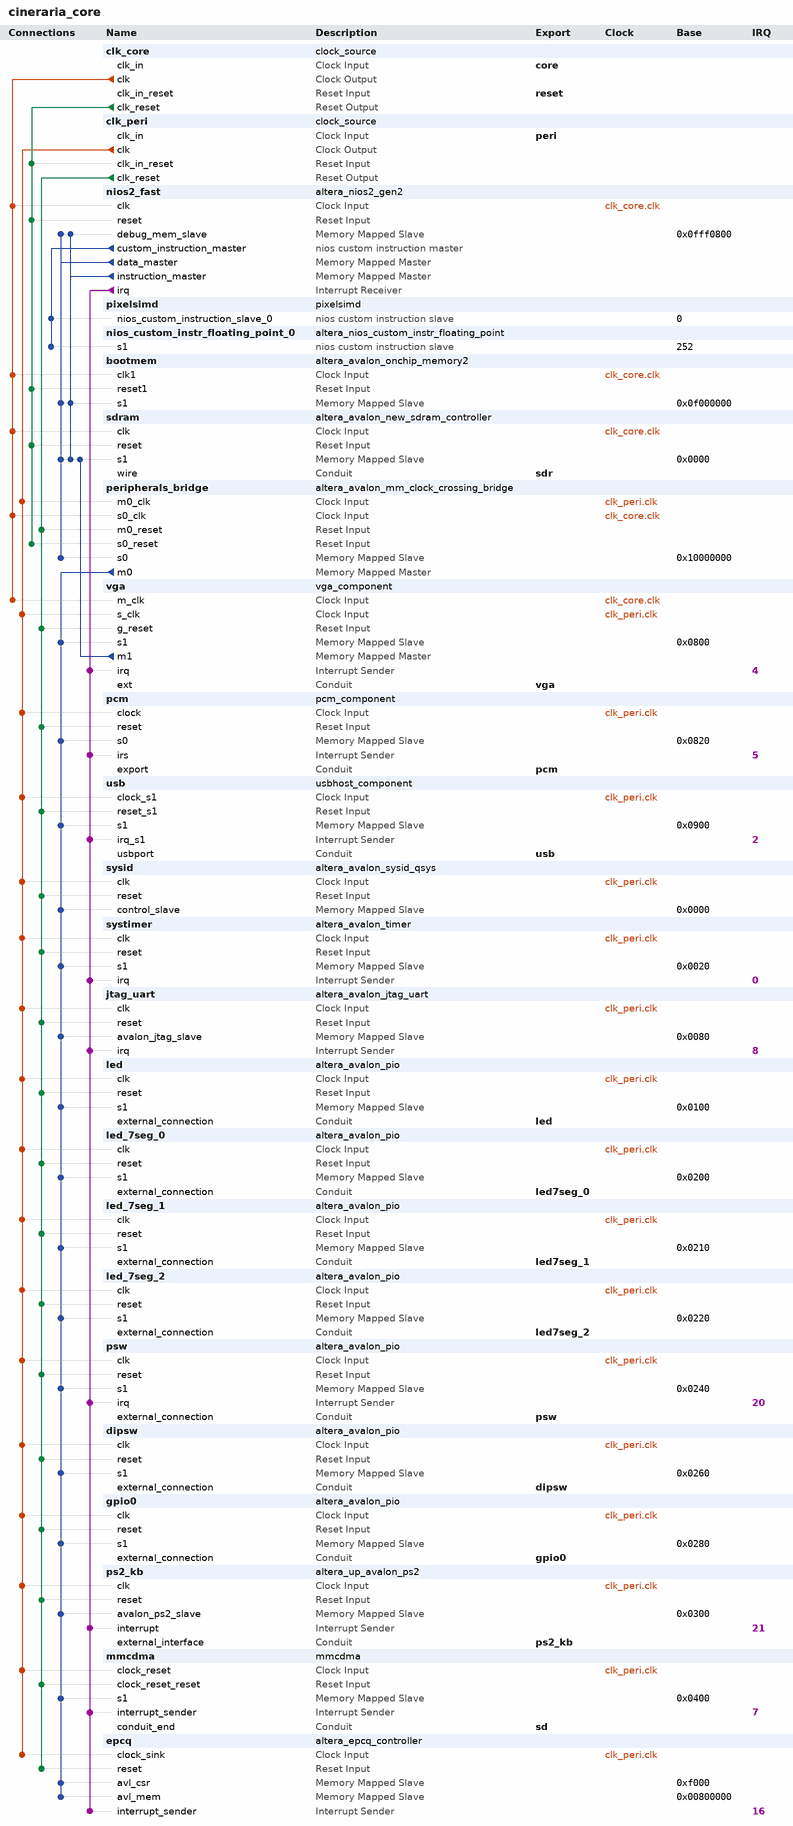
[diagram p0: system contents]
# Platform Designer (Qsys) system cineraria_core, Cyclone V 5CEBA4F23C7
# Parameters at their usual value, and those the tool derives, are not listed.
package require -exact qsys 15.0
create_system cineraria_core
set_project_property DEVICE_FAMILY {Cyclone V}
set_project_property DEVICE 5CEBA4F23C7

add_instance clk_core clock_source 15.0
set_instance_parameter_value clk_core clockFrequency 133333333

add_instance clk_peri clock_source 15.0
set_instance_parameter_value clk_peri clockFrequency 50000000

add_instance nios2_fast altera_nios2_gen2 15.0
set_instance_parameter_value nios2_fast dcache_bursts true
set_instance_parameter_value nios2_fast dcache_size 32768
set_instance_parameter_value nios2_fast dividerType srt2
set_instance_parameter_value nios2_fast exceptionSlave sdram.s1
set_instance_parameter_value nios2_fast icache_burstType Sequential
set_instance_parameter_value nios2_fast icache_size 32768
set_instance_parameter_value nios2_fast impl Fast
set_instance_parameter_value nios2_fast mul_64_impl 1
set_instance_parameter_value nios2_fast mul_shift_choice 1
set_instance_parameter_value nios2_fast resetSlave bootmem.s1

add_instance pixelsimd pixelsimd 1.0

add_instance nios_custom_instr_floating_point_0 altera_nios_custom_instr_floating_point 15.0

add_instance bootmem altera_avalon_onchip_memory2 15.0
set_instance_parameter_value bootmem dataWidth 32
set_instance_parameter_value bootmem dualPort false
set_instance_parameter_value bootmem initMemContent true
set_instance_parameter_value bootmem initializationFileName boot.hex
set_instance_parameter_value bootmem memorySize 65536
set_instance_parameter_value bootmem useNonDefaultInitFile true

add_instance sdram altera_avalon_new_sdram_controller 15.0
set_instance_parameter_value sdram TAC 5.4
set_instance_parameter_value sdram TRCD 15.0
set_instance_parameter_value sdram TRP 15.0
set_instance_parameter_value sdram casLatency 3
set_instance_parameter_value sdram columnWidth 10
set_instance_parameter_value sdram dataWidth 16
set_instance_parameter_value sdram generateSimulationModel false
set_instance_parameter_value sdram model single_Micron_MT48LC4M32B2_7_chip
set_instance_parameter_value sdram numberOfBanks 4
set_instance_parameter_value sdram numberOfChipSelects 1
set_instance_parameter_value sdram powerUpDelay 100.0
set_instance_parameter_value sdram refreshPeriod 7.8125
set_instance_parameter_value sdram rowWidth 13

add_instance peripherals_bridge altera_avalon_mm_clock_crossing_bridge 15.0
set_instance_parameter_value peripherals_bridge ADDRESS_WIDTH 10
set_instance_parameter_value peripherals_bridge COMMAND_FIFO_DEPTH 4
set_instance_parameter_value peripherals_bridge DATA_WIDTH 32
set_instance_parameter_value peripherals_bridge MASTER_SYNC_DEPTH 2
set_instance_parameter_value peripherals_bridge MAX_BURST_SIZE 1
set_instance_parameter_value peripherals_bridge RESPONSE_FIFO_DEPTH 4
set_instance_parameter_value peripherals_bridge SLAVE_SYNC_DEPTH 2
set_instance_parameter_value peripherals_bridge USE_AUTO_ADDRESS_WIDTH 1

add_instance vga vga_component 1.1
set_instance_parameter_value vga H_ACTIVE 640
set_instance_parameter_value vga H_BACKP 48
set_instance_parameter_value vga H_SYNC 96
set_instance_parameter_value vga H_TOTAL 800
set_instance_parameter_value vga LINEOFFSETBYTES 2048
set_instance_parameter_value vga V_ACTIVE 480
set_instance_parameter_value vga V_BACKP 33
set_instance_parameter_value vga V_SYNC 2
set_instance_parameter_value vga V_TOTAL 525

add_instance pcm pcm_component 1.0

add_instance usb usbhost_component 1.0
set_instance_parameter_value usb HOST_FIFO_ADDR_WIDTH 6
set_instance_parameter_value usb HOST_FIFO_DEPTH 64

add_instance sysid altera_avalon_sysid_qsys 15.0
set_instance_parameter_value sysid id 538249488

add_instance systimer altera_avalon_timer 15.0
set_instance_parameter_value systimer period 1
set_instance_parameter_value systimer periodUnits MSEC

add_instance jtag_uart altera_avalon_jtag_uart 15.0
set_instance_parameter_value jtag_uart simInteractiveOptions NO_INTERACTIVE_WINDOWS

add_instance led altera_avalon_pio 15.0
set_instance_parameter_value led direction Output
set_instance_parameter_value led width 10

add_instance led_7seg_0 altera_avalon_pio 15.0
set_instance_parameter_value led_7seg_0 direction Output
set_instance_parameter_value led_7seg_0 width 16

add_instance led_7seg_1 altera_avalon_pio 15.0
set_instance_parameter_value led_7seg_1 direction Output
set_instance_parameter_value led_7seg_1 width 16

add_instance led_7seg_2 altera_avalon_pio 15.0
set_instance_parameter_value led_7seg_2 direction Output
set_instance_parameter_value led_7seg_2 width 16

add_instance psw altera_avalon_pio 15.0
set_instance_parameter_value psw captureEdge true
set_instance_parameter_value psw direction Input
set_instance_parameter_value psw edgeType FALLING
set_instance_parameter_value psw generateIRQ true
set_instance_parameter_value psw irqType EDGE
set_instance_parameter_value psw width 4

add_instance dipsw altera_avalon_pio 15.0
set_instance_parameter_value dipsw direction Input
set_instance_parameter_value dipsw width 10

add_instance gpio0 altera_avalon_pio 15.0
set_instance_parameter_value gpio0 direction Bidir
set_instance_parameter_value gpio0 width 32

add_instance ps2_kb altera_up_avalon_ps2 15.0

add_instance mmcdma mmcdma 1.0
set_instance_parameter_value mmcdma SYSTEMCLOCKINFO 50000000

add_instance epcq altera_epcq_controller 15.0
set_instance_parameter_value epcq CHIP_SELS 1
set_instance_parameter_value epcq DDASI 0
set_instance_parameter_value epcq FLASH_TYPE EPCS64
set_instance_parameter_value epcq IO_MODE STANDARD

# connections
add_connection clk_core.clk bootmem.clk1 clock
add_connection clk_core.clk nios2_fast.clk clock
add_connection clk_core.clk peripherals_bridge.s0_clk clock
add_connection clk_core.clk sdram.clk clock
add_connection clk_core.clk vga.m_clk clock
add_connection clk_peri.clk dipsw.clk clock
add_connection clk_peri.clk epcq.clock_sink clock
add_connection clk_peri.clk gpio0.clk clock
add_connection clk_peri.clk jtag_uart.clk clock
add_connection clk_peri.clk led.clk clock
add_connection clk_peri.clk led_7seg_0.clk clock
add_connection clk_peri.clk led_7seg_1.clk clock
add_connection clk_peri.clk led_7seg_2.clk clock
add_connection clk_peri.clk mmcdma.clock_reset clock
add_connection clk_peri.clk pcm.clock clock
add_connection clk_peri.clk peripherals_bridge.m0_clk clock
add_connection clk_peri.clk ps2_kb.clk clock
add_connection clk_peri.clk psw.clk clock
add_connection clk_peri.clk sysid.clk clock
add_connection clk_peri.clk systimer.clk clock
add_connection clk_peri.clk usb.clock_s1 clock
add_connection clk_peri.clk vga.s_clk clock
add_connection clk_core.clk_reset bootmem.reset1 reset
add_connection clk_core.clk_reset clk_peri.clk_in_reset reset
add_connection clk_core.clk_reset nios2_fast.reset reset
add_connection clk_core.clk_reset peripherals_bridge.s0_reset reset
add_connection clk_core.clk_reset sdram.reset reset
add_connection clk_peri.clk_reset dipsw.reset reset
add_connection clk_peri.clk_reset epcq.reset reset
add_connection clk_peri.clk_reset gpio0.reset reset
add_connection clk_peri.clk_reset jtag_uart.reset reset
add_connection clk_peri.clk_reset led.reset reset
add_connection clk_peri.clk_reset led_7seg_0.reset reset
add_connection clk_peri.clk_reset led_7seg_1.reset reset
add_connection clk_peri.clk_reset led_7seg_2.reset reset
add_connection clk_peri.clk_reset mmcdma.clock_reset_reset reset
add_connection clk_peri.clk_reset pcm.reset reset
add_connection clk_peri.clk_reset peripherals_bridge.m0_reset reset
add_connection clk_peri.clk_reset ps2_kb.reset reset
add_connection clk_peri.clk_reset psw.reset reset
add_connection clk_peri.clk_reset sysid.reset reset
add_connection clk_peri.clk_reset systimer.reset reset
add_connection clk_peri.clk_reset usb.reset_s1 reset
add_connection clk_peri.clk_reset vga.g_reset reset
add_connection nios2_fast.data_master bootmem.s1 avalon
set_connection_parameter_value nios2_fast.data_master/bootmem.s1 baseAddress 0x0f000000
add_connection nios2_fast.data_master nios2_fast.debug_mem_slave avalon
set_connection_parameter_value nios2_fast.data_master/nios2_fast.debug_mem_slave baseAddress 0x0fff0800
add_connection nios2_fast.data_master peripherals_bridge.s0 avalon
set_connection_parameter_value nios2_fast.data_master/peripherals_bridge.s0 baseAddress 0x10000000
add_connection nios2_fast.data_master sdram.s1 avalon
set_connection_parameter_value nios2_fast.data_master/sdram.s1 baseAddress 0x0000
add_connection nios2_fast.instruction_master bootmem.s1 avalon
set_connection_parameter_value nios2_fast.instruction_master/bootmem.s1 baseAddress 0x0f000000
add_connection nios2_fast.instruction_master nios2_fast.debug_mem_slave avalon
set_connection_parameter_value nios2_fast.instruction_master/nios2_fast.debug_mem_slave baseAddress 0x0fff0800
add_connection nios2_fast.instruction_master sdram.s1 avalon
set_connection_parameter_value nios2_fast.instruction_master/sdram.s1 baseAddress 0x0000
add_connection peripherals_bridge.m0 dipsw.s1 avalon
set_connection_parameter_value peripherals_bridge.m0/dipsw.s1 baseAddress 0x0260
add_connection peripherals_bridge.m0 epcq.avl_csr avalon
set_connection_parameter_value peripherals_bridge.m0/epcq.avl_csr baseAddress 0xf000
add_connection peripherals_bridge.m0 epcq.avl_mem avalon
set_connection_parameter_value peripherals_bridge.m0/epcq.avl_mem baseAddress 0x00800000
add_connection peripherals_bridge.m0 gpio0.s1 avalon
set_connection_parameter_value peripherals_bridge.m0/gpio0.s1 baseAddress 0x0280
add_connection peripherals_bridge.m0 jtag_uart.avalon_jtag_slave avalon
set_connection_parameter_value peripherals_bridge.m0/jtag_uart.avalon_jtag_slave baseAddress 0x0080
add_connection peripherals_bridge.m0 led.s1 avalon
set_connection_parameter_value peripherals_bridge.m0/led.s1 baseAddress 0x0100
add_connection peripherals_bridge.m0 led_7seg_0.s1 avalon
set_connection_parameter_value peripherals_bridge.m0/led_7seg_0.s1 baseAddress 0x0200
add_connection peripherals_bridge.m0 led_7seg_1.s1 avalon
set_connection_parameter_value peripherals_bridge.m0/led_7seg_1.s1 baseAddress 0x0210
add_connection peripherals_bridge.m0 led_7seg_2.s1 avalon
set_connection_parameter_value peripherals_bridge.m0/led_7seg_2.s1 baseAddress 0x0220
add_connection peripherals_bridge.m0 mmcdma.s1 avalon
set_connection_parameter_value peripherals_bridge.m0/mmcdma.s1 baseAddress 0x0400
add_connection peripherals_bridge.m0 pcm.s0 avalon
set_connection_parameter_value peripherals_bridge.m0/pcm.s0 baseAddress 0x0820
add_connection peripherals_bridge.m0 ps2_kb.avalon_ps2_slave avalon
set_connection_parameter_value peripherals_bridge.m0/ps2_kb.avalon_ps2_slave baseAddress 0x0300
add_connection peripherals_bridge.m0 psw.s1 avalon
set_connection_parameter_value peripherals_bridge.m0/psw.s1 baseAddress 0x0240
add_connection peripherals_bridge.m0 sysid.control_slave avalon
set_connection_parameter_value peripherals_bridge.m0/sysid.control_slave baseAddress 0x0000
add_connection peripherals_bridge.m0 systimer.s1 avalon
set_connection_parameter_value peripherals_bridge.m0/systimer.s1 baseAddress 0x0020
add_connection peripherals_bridge.m0 usb.s1 avalon
set_connection_parameter_value peripherals_bridge.m0/usb.s1 baseAddress 0x0900
add_connection peripherals_bridge.m0 vga.s1 avalon
set_connection_parameter_value peripherals_bridge.m0/vga.s1 baseAddress 0x0800
add_connection vga.m1 sdram.s1 avalon
set_connection_parameter_value vga.m1/sdram.s1 baseAddress 0x0000
add_connection nios2_fast.irq epcq.interrupt_sender interrupt
set_connection_parameter_value nios2_fast.irq/epcq.interrupt_sender irqNumber 16
add_connection nios2_fast.irq jtag_uart.irq interrupt
set_connection_parameter_value nios2_fast.irq/jtag_uart.irq irqNumber 8
add_connection nios2_fast.irq mmcdma.interrupt_sender interrupt
set_connection_parameter_value nios2_fast.irq/mmcdma.interrupt_sender irqNumber 7
add_connection nios2_fast.irq pcm.irs interrupt
set_connection_parameter_value nios2_fast.irq/pcm.irs irqNumber 5
add_connection nios2_fast.irq ps2_kb.interrupt interrupt
set_connection_parameter_value nios2_fast.irq/ps2_kb.interrupt irqNumber 21
add_connection nios2_fast.irq psw.irq interrupt
set_connection_parameter_value nios2_fast.irq/psw.irq irqNumber 20
add_connection nios2_fast.irq systimer.irq interrupt
set_connection_parameter_value nios2_fast.irq/systimer.irq irqNumber 0
add_connection nios2_fast.irq usb.irq_s1 interrupt
set_connection_parameter_value nios2_fast.irq/usb.irq_s1 irqNumber 2
add_connection nios2_fast.irq vga.irq interrupt
set_connection_parameter_value nios2_fast.irq/vga.irq irqNumber 4
add_connection nios2_fast.custom_instruction_master nios_custom_instr_floating_point_0.s1 nios_custom_instruction
set_connection_parameter_value nios2_fast.custom_instruction_master/nios_custom_instr_floating_point_0.s1 CIName nios_custom_instr_floating_point_0
set_connection_parameter_value nios2_fast.custom_instruction_master/nios_custom_instr_floating_point_0.s1 baseAddress 252
add_connection nios2_fast.custom_instruction_master pixelsimd.nios_custom_instruction_slave_0 nios_custom_instruction
set_connection_parameter_value nios2_fast.custom_instruction_master/pixelsimd.nios_custom_instruction_slave_0 CIName pixelsimd
set_connection_parameter_value nios2_fast.custom_instruction_master/pixelsimd.nios_custom_instruction_slave_0 baseAddress 0

# exported interfaces
add_interface core clock sink
set_interface_property core EXPORT_OF clk_core.clk_in
add_interface dipsw conduit end
set_interface_property dipsw EXPORT_OF dipsw.external_connection
add_interface gpio0 conduit end
set_interface_property gpio0 EXPORT_OF gpio0.external_connection
add_interface led conduit end
set_interface_property led EXPORT_OF led.external_connection
add_interface led7seg_0 conduit end
set_interface_property led7seg_0 EXPORT_OF led_7seg_0.external_connection
add_interface led7seg_1 conduit end
set_interface_property led7seg_1 EXPORT_OF led_7seg_1.external_connection
add_interface led7seg_2 conduit end
set_interface_property led7seg_2 EXPORT_OF led_7seg_2.external_connection
add_interface pcm conduit end
set_interface_property pcm EXPORT_OF pcm.export
add_interface peri clock sink
set_interface_property peri EXPORT_OF clk_peri.clk_in
add_interface ps2_kb conduit end
set_interface_property ps2_kb EXPORT_OF ps2_kb.external_interface
add_interface psw conduit end
set_interface_property psw EXPORT_OF psw.external_connection
add_interface reset reset sink
set_interface_property reset EXPORT_OF clk_core.clk_in_reset
add_interface sd conduit end
set_interface_property sd EXPORT_OF mmcdma.conduit_end
add_interface sdr conduit end
set_interface_property sdr EXPORT_OF sdram.wire
add_interface usb conduit end
set_interface_property usb EXPORT_OF usb.usbport
add_interface vga conduit end
set_interface_property vga EXPORT_OF vga.ext

set_interconnect_requirement {$system} qsys_mm.clockCrossingAdapter HANDSHAKE
set_interconnect_requirement {$system} qsys_mm.enableEccProtection FALSE
set_interconnect_requirement {$system} qsys_mm.insertDefaultSlave FALSE
set_interconnect_requirement {$system} qsys_mm.maxAdditionalLatency 1

save_system cineraria_core.qsys
